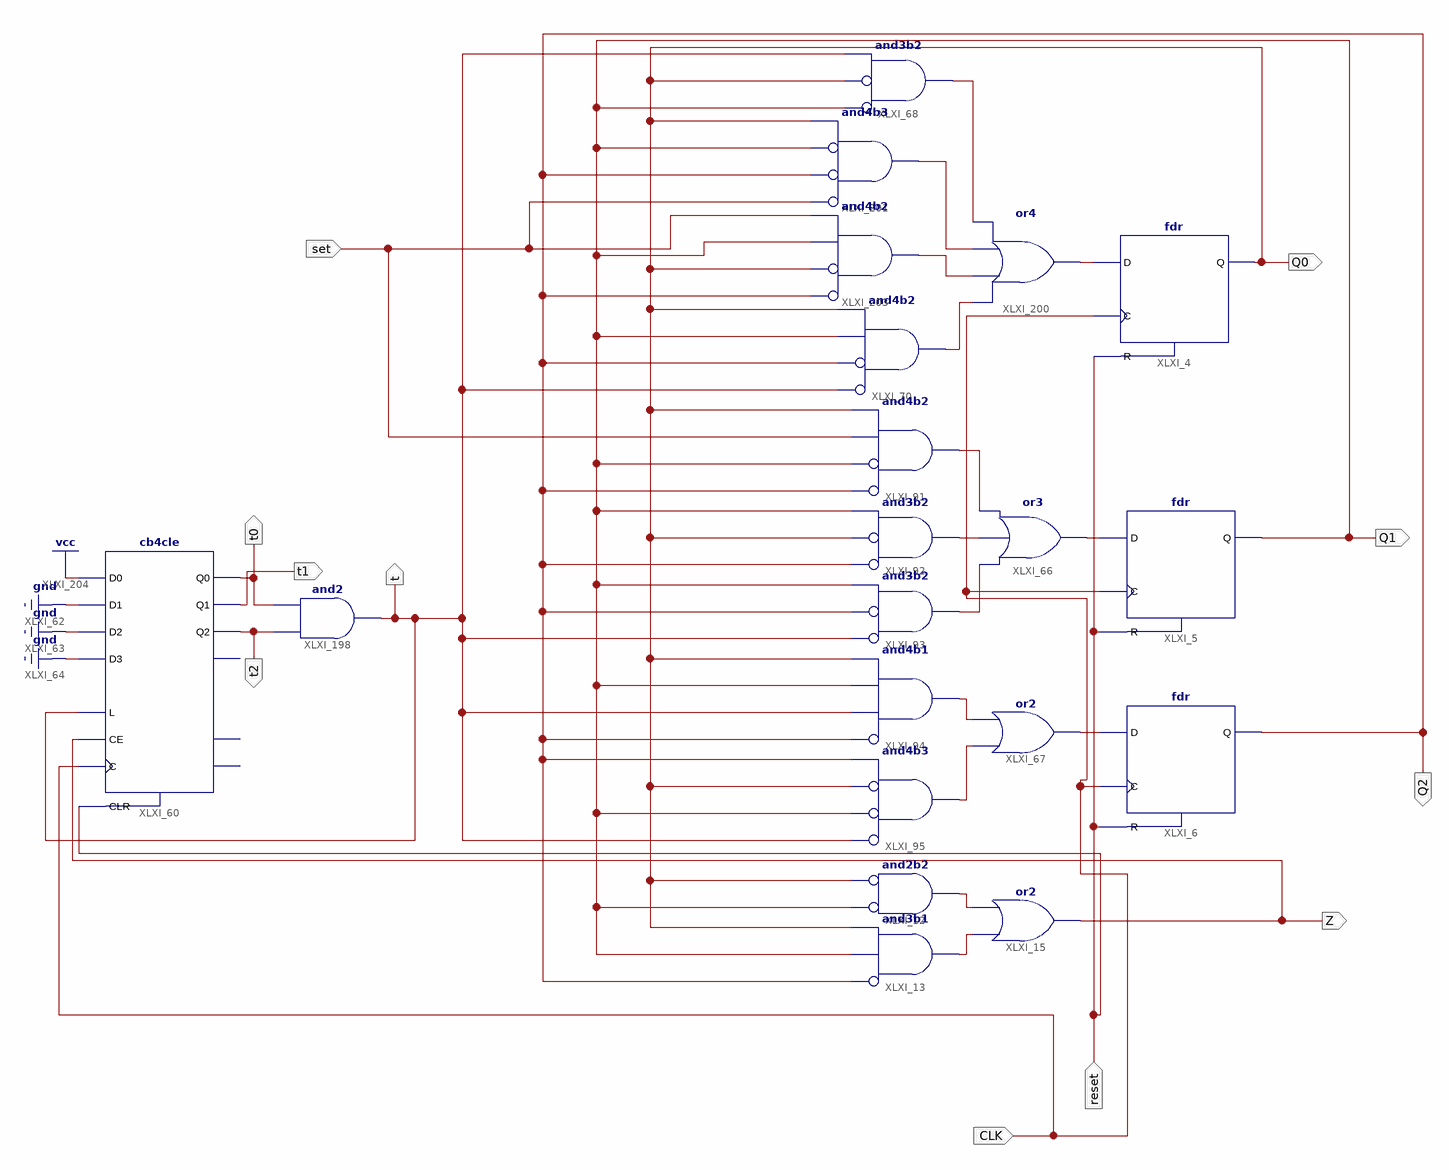
[diagram p0: schematic sheet 1]
// Xilinx ISE schematic timer_design.sch (spartan3) as structural Verilog: 20 symbols, 11 ports
module timer_design (
  input  reset,
  input  set,
  input  CLK,
  output Z,
  output Q0,
  output Q1,
  output Q2,
  output t2,
  output t0,
  output t,
  output t1
);

  wire XLXN_1, XLXN_2, XLXN_4, XLXN_29, XLXN_30, XLXN_72, XLXN_73, XLXN_74, XLXN_75, XLXN_76, XLXN_251,
       XLXN_252, XLXN_268, XLXN_269;

  fdr XLXI_5 (.C(CLK), .D(XLXN_2), .R(reset), .Q(Q1));
  or XLXI_15 (Z, XLXN_30, XLXN_29);
  or XLXI_66 (XLXN_2, XLXN_74, XLXN_72, XLXN_73);
  or XLXI_67 (XLXN_4, XLXN_76, XLXN_75);
  fdr XLXI_6 (.C(CLK), .D(XLXN_4), .R(reset), .Q(Q2));
  fdr XLXI_4 (.C(CLK), .D(XLXN_1), .R(reset), .Q(Q0));
  and XLXI_70 (XLXN_251, ~t, ~Q2, Q1, Q0);  // and4b2
  and XLXI_68 (XLXN_252, ~Q1, ~Q0, t);  // and3b2
  and XLXI_91 (XLXN_73, ~Q2, ~Q1, set, Q0);  // and4b2
  and XLXI_92 (XLXN_72, ~Q2, ~Q0, Q1);  // and3b2
  and XLXI_93 (XLXN_74, ~t, ~Q2, Q1);  // and3b2
  and XLXI_94 (XLXN_75, ~Q2, t, Q1, Q0);  // and4b1
  and XLXI_95 (XLXN_76, ~t, ~Q1, ~Q0, Q2);  // and4b3
  and XLXI_12 (XLXN_29, ~Q1, ~Q0);  // and2b2
  and XLXI_13 (XLXN_30, ~Q2, Q1, Q0);  // and3b1
  cb4cle XLXI_60 (
    .C(CLK), .CE(Z), .CLR(reset), .D0(1'b1), .D1(1'b0), .D2(1'b0), .D3(1'b0), .L(t), .Q0(t0), .Q1(t1), .Q2(t2));  // open: CEO, Q3, TC
  and XLXI_198 (t, t2, t0);
  or XLXI_200 (XLXN_1, XLXN_251, XLXN_269, XLXN_268, XLXN_252);
  and XLXI_201 (XLXN_268, ~set, ~Q2, ~Q1, Q0);  // and4b3
  and XLXI_203 (XLXN_269, ~Q2, ~Q0, Q1, set);  // and4b2
endmodule
